# EAGLE design gpio expander (EAGLE 9.4.2)
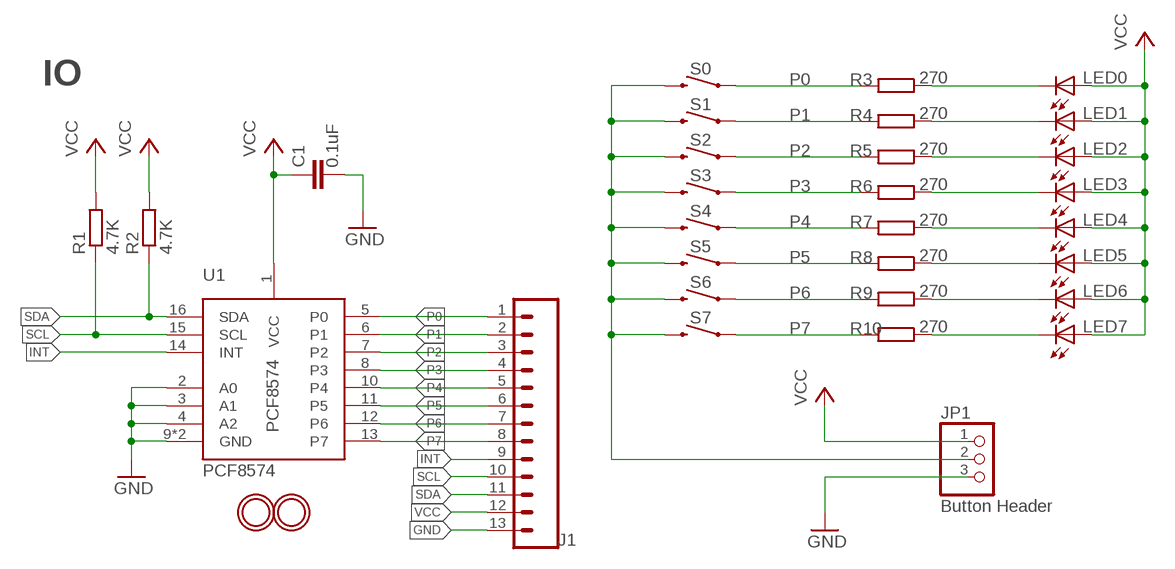
[diagram p0: schematic, sheet 1]

## Parts
C1  0.1uF  C-EUC0805K  [C0805K]
J1  GPIO Expander Pins  CONN_13  [1X13_NO_SILK]
JP1  Button Header  PINHD-1X3  [1X03]
LED0  GREEN  LEDCHIP-LED0805  [CHIP-LED0805]
LED1  GREEN  LEDCHIP-LED0805  [CHIP-LED0805]
LED2  GREEN  LEDCHIP-LED0805  [CHIP-LED0805]
LED3  GREEN  LEDCHIP-LED0805  [CHIP-LED0805]
LED4  GREEN  LEDCHIP-LED0805  [CHIP-LED0805]
LED5  GREEN  LEDCHIP-LED0805  [CHIP-LED0805]
LED6  GREEN  LEDCHIP-LED0805  [CHIP-LED0805]
LED7  GREEN  LEDCHIP-LED0805  [CHIP-LED0805]
MH1  MOUNTINGHOLE2.5  [MOUNTINGHOLE_2.5_PLATED]
MH3  MOUNTINGHOLE2.5  [MOUNTINGHOLE_2.5_PLATED]
R1  4.7K  R-EU_R0805  [R0805]
R2  4.7K  R-EU_R0805  [R0805]
R3  270  R-EU_R0805  [R0805]
R4  270  R-EU_R0805  [R0805]
R5  270  R-EU_R0805  [R0805]
R6  270  R-EU_R0805  [R0805]
R7  270  R-EU_R0805  [R0805]
R8  270  R-EU_R0805  [R0805]
R9  270  R-EU_R0805  [R0805]
R10  270  R-EU_R0805  [R0805]
S0  MOMENTARY-SWITCH-SPST-SMD-4.6X2.8MM  [TACTILE_SWITCH_SMD_4.6X2.8MM]
S1  MOMENTARY-SWITCH-SPST-SMD-4.6X2.8MM  [TACTILE_SWITCH_SMD_4.6X2.8MM]
S2  MOMENTARY-SWITCH-SPST-SMD-4.6X2.8MM  [TACTILE_SWITCH_SMD_4.6X2.8MM]
S3  MOMENTARY-SWITCH-SPST-SMD-4.6X2.8MM  [TACTILE_SWITCH_SMD_4.6X2.8MM]
S4  MOMENTARY-SWITCH-SPST-SMD-4.6X2.8MM  [TACTILE_SWITCH_SMD_4.6X2.8MM]
S5  MOMENTARY-SWITCH-SPST-SMD-4.6X2.8MM  [TACTILE_SWITCH_SMD_4.6X2.8MM]
S6  MOMENTARY-SWITCH-SPST-SMD-4.6X2.8MM  [TACTILE_SWITCH_SMD_4.6X2.8MM]
S7  MOMENTARY-SWITCH-SPST-SMD-4.6X2.8MM  [TACTILE_SWITCH_SMD_4.6X2.8MM]
U1  PCF8574  [QFN-16-3MM]

## Nets
GND [power1]: C1.2 J1.13 JP1.3 U1.2(A0) U1.3(A1) U1.4(A2) U1.9(GND) U1.P$1(GND)
INT: J1.9 U1.14(INT)
N$1: JP1.2 S0.3 S0.4 S1.3 S1.4 S2.3 S2.4 S3.3 S3.4 S4.3 S4.4 S5.3 S5.4 S6.3 S6.4 S7.3 S7.4
N$2: LED0.C R3.1
N$11: LED1.C R4.1
N$12: LED2.C R5.1
N$13: LED3.C R6.1
N$14: LED4.C R7.1
N$15: LED5.C R8.1
N$16: LED6.C R9.1
N$17: LED7.C R10.1
P0: J1.1 R3.2 S0.1 S0.2 U1.5(P0)
P1: J1.2 R4.2 S1.1 S1.2 U1.6(P1)
P2: J1.3 R5.2 S2.1 S2.2 U1.7(P2)
P3: J1.4 R6.2 S3.1 S3.2 U1.8(P3)
P4: J1.5 R7.2 S4.1 S4.2 U1.10(P4)
P5: J1.6 R8.2 S5.1 S5.2 U1.11(P5)
P6: J1.7 R9.2 S6.1 S6.2 U1.12(P6)
P7: J1.8 R10.2 S7.1 S7.2 U1.13(P7)
SCL: J1.10 R1.1 U1.15(SCL)
SDA: J1.11 R2.1 U1.16(SDA)
VCC [power1]: C1.1 J1.12 JP1.1 LED0.A LED1.A LED2.A LED3.A LED4.A LED5.A LED6.A LED7.A R1.2 R2.2 U1.1(VCC)

## Notes on the sheet
- IO

## Library data of the parts
C1 = rcl:C-EU: CAPACITOR, European symbol; SPICEPREFIX: C
J1 = AK74:CONN_13
JP1 = pinhead:PINHD-1X3: PIN HEADER
LED0 LED1-LED7 = led:LED: LED OSRAM: - CHIPLED LG R971, LG N971, LY N971, LG Q971, LY Q971, LO R971, LY R971 LH N974, LH R974 LS Q976, LO Q976, LY Q976 LO Q996 - Hyper CHIPLED LW Q18S LB Q993, LB Q99A, LB R99A - SideLED LS A670, LO A670, LY A670, LG A670, LP A670 LB A673, LV A673, LT A673, LW A673 LH A674 LY A675 LS A676, LA A676, LO A676, LY A676, LW A676 LS A679, LY A679, LG A679 - Hyper Micro SIDELED® LS Y876, LA Y876, LO Y876, LY Y876 LT Y87S - SmartLED LW L88C, LW L88S LB L89C, LB L89S, LG L890 LS L89K, LO L89K, LY L89K LS L896, LA L896, LO L896, LY L896 - TOPLED LS T670, LO T670, LY T670, LG T670, LP T670 LSG T670, LSP T670, LSY T670, LOP T670, LYG T670 LG T671, LOG T671, LSG T671 LB T673, LV T673, LT T673, LW T673 LH T674 LS T676, LA T676, LO T676, LY T676, LB T676, LH T676, LSB T676, LW T676 LB T67C, LV T67C, LT T67C, LS T67K, LO T67K, LY T67K, LW E67C LS E67B, LA E67B, LO E67B, LY E67B, LB E67C, LV E67C, LT E67C LW T67C LS T679, LY T679, LG T679 LS T770, LO T770, LY T770, LG T770, LP T770 LB T773, LV T773, LT T773, LW T773 LH T774 LS E675, LA E675, LY E675, LS T675 LS T776, LA T776, LO T776, LY T776, LB T776 LHGB T686 LT T68C, LB T68C - Hyper Mini TOPLED® LB M676 - Mini TOPLED Santana® LG M470 LS M47K, LO M47K, LY M47K Source: http://www.osram.convergy.de LUXEON: - LUMILED® LXK2-PW12-R00, LXK2-PW12-S00, LXK2-PW14-U00, LXK2-PW14-V00 LXK2-PM12-R00, LXK2-PM12-S00, LXK2-PM14-U00 LXK2-PE12-Q00, LXK2-PE12-R00, LXK2-PE12-S00, LXK2-PE14-T00, LXK2-PE14-U00 LXK2-PB12-K00, LXK2-PB12-L00, LXK2-PB12-M00, LXK2-PB14-N00, LXK2-PB14-P00, LXK2-PB14-Q00 LXK2-PR12-L00, LXK2-PR12-M00, LXK2-PR14-Q00, LXK2-PR14-R00 LXK2-PD12-Q00, LXK2-PD12-R00, LXK2-PD12-S00 LXK2-PH12-R00, LXK2-PH12-S00 LXK2-PL12-P00, LXK2-PL12-Q00, LXK2-PL12-R00 Source: www.luxeon.com KINGBRIGHT: KA-3528ASYC Source: www.kingbright.com
MH1 MH3 = microbuilder:MOUNTINGHOLE: Mounting Hole For #2 screws (0.086"/2.18mm width, 0.094"/2.4mm hole) use 2.5mm
R1-R10 = rcl:R-EU_: RESISTOR, European symbol; SPICEPREFIX: R
S0 S1-S7 = SparkFun-Switches:MOMENTARY-SWITCH-SPST: Momentary Switch (Pushbutton) - SPST Normally-open (NO) SPST momentary switches (buttons, pushbuttons). Variants PTH-12MM - 12mm square, through-hole Momentary Pushbutton Switch - 12mm Square <https://www.sparkfun.com/products/9190> (COM-09190) PTH-6.0MM, PTH-6.0MM-KIT - 6.0mm square, through-hole Mini Pushbutton Switch <https://www.sparkfun.com/products/97> (COM-00097) KIT package intended for soldering kit's - only one side of pads' copper is exposed. PTH-RIGHT-ANGLE-KIT - Right-angle, through-hole Right Angle Tactile Button <https://www.sparkfun.com/products/10791> - Used on SparkFun BigTime Watch Kit <https://www.sparkfun.com/products/11734> SMD-12MM - 12mm square, surface-mount Tactile Button - SMD (12mm) <https://www.sparkfun.com/products/12993> (COM-12993) Used on SparkFun PicoBoard <https://www.sparkfun.com/products/11888> SMD-4.5MM - 4.5mm Square Trackball Switch Used on SparkFun Blackberry Trackballer Breakout <https://www.sparkfun.com/products/13169> SMD-4.6MMX2.8MM - 4.60mm x 2.80mm, surface mount Used on SparkFun SAMD21 Mini Breakout <https://www.sparkfun.com/products/13664> SMD-5.2MM, SMD-5.2-REDUNDANT - 5.2mm square, surface-mount Mini Pushbutton Switch - SMD <https://www.sparkfun.com/products/8720> (COM-08720) Used on Arduino Pro Mini <https://www.sparkfun.com/products/11114> REDUNDANT package connects both switch circuits together SMD-6.0X3.5MM - 6.0 x 3.5mm, surface mount Momentary Reset Switch SMD <https://www.sparkfun.com/products/8229> (COM-08229) SMD-6.2MM-TALL - 6.2mm square, surface mount Tactile Button - SMD (6mm) <https://www.sparkfun.com/products/12992> Used on SparkFun Digital Sandbox <https://www.sparkfun.com/products/12651> SMD-RIGHT-ANGLE - Right-angle, surface mount Used on SparkFun Block for Intel® Edison - Arduino <https://www.sparkfun.com/products/13036>; PROD_ID: SWCH-13065
U1 = AK74:PCF8574

## Net classes
0 default: width 0.152 mm
1 power1: width 0.254 mm

## Board
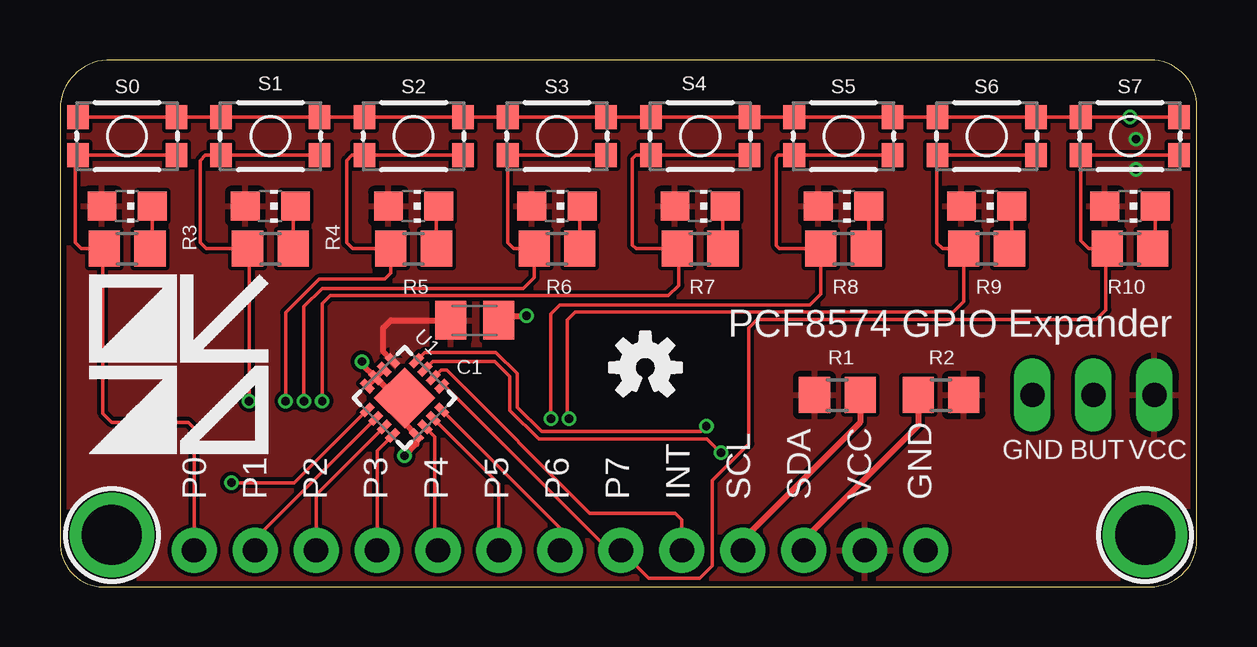
[diagram p1: board, top side]
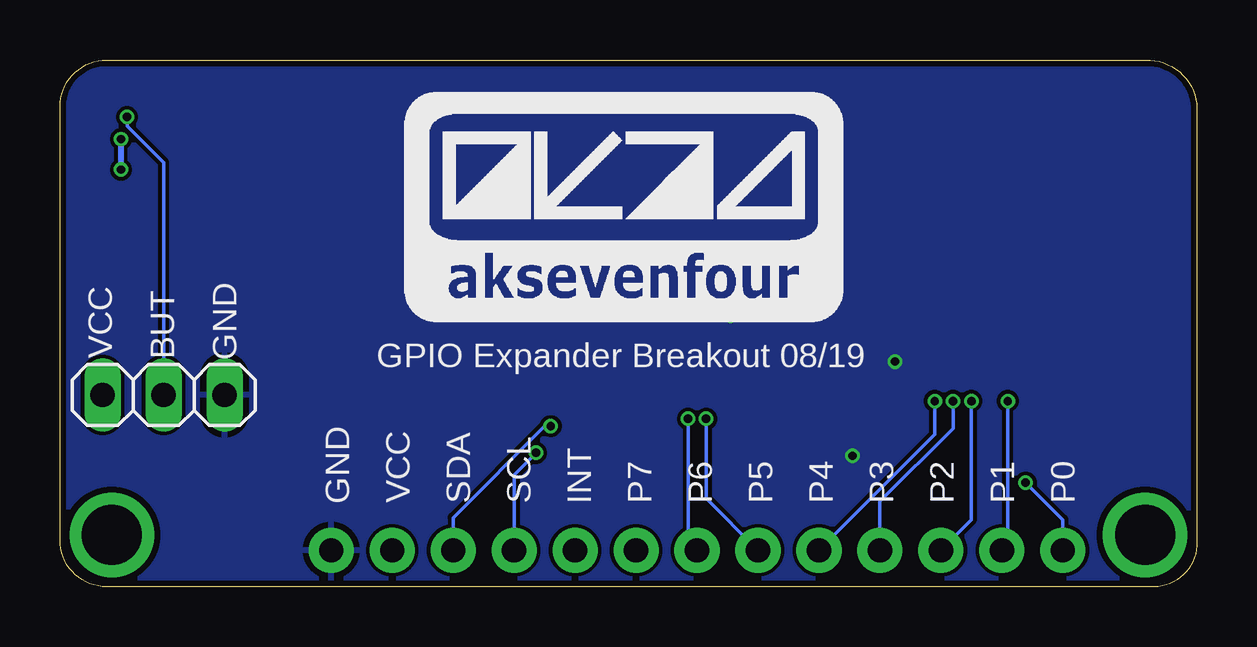
[diagram p2: board, bottom side, seen from below]

Size 47.37 x 21.97 mm. Coordinates in mm from the lower left corner, seen from the top.
Outline: 1.96,0 45.43,0 arc90 47.37,1.96 47.37,20.02 arc90 45.43,21.97 1.95,21.97 arc90 0,19.76 0,1.71 arc90 1.96,0
Copper layers (1*16): Top 0.07mm / dielectric 1.5mm / Bottom 0.07mm
Design rules "jlcpcb-2layer": minimum track width 5mil, minimum drill 0.2mm, track to track 6mil, track to pad 6mil, pad to pad 6mil, via to via 6mil, smd to smd 6mil, copper to edge 10mil, drill to drill 5mil, minimum pad ring 10mil, minimum via ring 5mil, stop-mask expansion 2mil, vias tented up to drill 0mil, thermal gap 10mil

### Footprints (pad centres in the part's own frame; a part is rotated, then mirrored left to right if it is on the bottom)
C0805K = smd 1.3 x 1.6: 1 -1,0; 2 1,0
1X13_NO_SILK = drill 1.016 pad 1.88: 1 0,0; 2 2.54,0; 3 5.08,0; 4 7.62,0; 5 10.16,0; 6 12.7,0; 7 15.24,0; 8 17.78,0; 9 20.32,0; 10 22.86,0; 11 25.4,0; 12 27.94,0; 13 30.48,0
1X03 = drill 1.016 long: 1 -2.54,0; 2 0,0; 3 2.54,0
CHIP-LED0805 = smd 1.2 x 1.2: A 0,-1.05; C 0,1.05
MOUNTINGHOLE_2.5_PLATED = drill 2.5 pad 3.2: P$1 0,0
R0805 = smd 1.3 x 1.5: 1 -0.95,0; 2 0.95,0
TACTILE_SWITCH_SMD_4.6X2.8MM = smd 0.9 x 1: 1 -2.05,-0.8; 2 2.05,-0.8; 3 2.05,0.8; 4 -2.05,0.8
QFN-16-3MM = smd 0.6 x 0.3: 1 -1.45,0.75; 2 -1.45,0.25; 3 -1.45,-0.25; 4 -1.45,-0.75; 9 1.45,-0.75; 10 1.45,-0.25; 11 1.45,0.25; 12 1.45,0.75 | smd 0.3 x 0.6: 5 -0.75,-1.45; 6 -0.25,-1.45; 7 0.25,-1.45; 8 0.75,-1.45; 13 0.75,1.45; 14 0.25,1.45; 15 -0.25,1.45; 16 -0.75,1.45 | smd 1.8 x 1.8: P$1 0,0

### Placement (x,y rotation side)
C1  17.28,11.12 0 top
J1  5.59,1.53 0 top
JP1  43.06,8 0 bottom
LED0  2.8,15.88 270 top
LED1  8.77,15.88 270 top
LED2  14.74,15.88 270 top
LED3  20.7,15.88 270 top
LED4  26.67,15.88 270 top
LED5  32.64,15.88 270 top
LED6  38.61,15.88 270 top
LED7  44.58,15.88 270 top
MH1  45.22,2.16 180 top
MH3  2.16,2.16 180 top
R1  32.39,8 180 top
R2  36.71,8 0 top
R3  2.8,14.1 180 top
R4  8.77,14.1 180 top
R5  14.74,14.1 180 top
R6  20.7,14.1 180 top
R7  26.67,14.1 180 top
R8  32.64,14.1 180 top
R9  38.61,14.1 180 top
R10  44.58,14.1 180 top
S0  2.8,18.8 0 top
S1  8.77,18.8 0 top
S2  14.74,18.8 0 top
S3  20.7,18.8 0 top
S4  26.67,18.8 0 top
S5  32.64,18.8 0 top
S6  38.61,18.8 0 top
S7  44.58,18.8 0 top
U1  14.35,7.88 315 top
U$1  [AK74_LOGO_MEDIUM]  24.12,17.4 0 bottom
U$2  [AK74_LOGO_MEDIUM_TEXTONLY_SQUARE]  8.51,11.43 0 top
U$3  [OSHW-LOGO-S]  24.39,9.15 0 top

### Tracks (layer width: path | path; a pad name or v marks a point on that pad's centre or on a via)
GND  (via drill 0.35)
  Top 0.254: U1.3 12.58,9.3 v12.58,9.4 | v14.35,5.46 14.85,5.96 U1.9 14.35,6.82 U1.P$1 14,7.88 U1.3 | C1.2 18.47,11.31 v19.43,11.31 | U1.4 | U1.4 U1.3 | U1.3 U1.2
  pour Bottom: 48.71,-1.46 48.71,26.29 -1.39,26.55 -1.39,-1.46
INT
  Top 0.152: U1.14 15.88,9.05 16.11,9.05 22.08,3.08 25.63,3.08 25.91,2.8 J1.9
N$1  (via drill 0.35)
  Top 0.152: S0.4 S0.3 S1.4 S1.3 S2.4 S2.3 S3.4 S3.3 S4.4 S4.3 S5.4 S5.3 S6.4 S6.3 S7.4 v44.58,19.6 S7.3
  Bottom 0.152: JP1.2 43.06,17.69 44.58,19.22 v44.58,19.6
N$2
  Top 0.152: R3.1 3.85,14.2 LED0.C
N$11
  Top 0.152: R4.1 9.72,15.78 LED1.C
N$12
  Top 0.152: R5.1 15.69,15.78 LED2.C
N$13
  Top 0.152: R6.1 21.65,15.78 LED3.C
N$14
  Top 0.152: R7.1 27.62,15.78 LED4.C
N$15
  Top 0.152: LED5.C 33.69,14.2 R8.1
N$16
  Top 0.152: LED6.C 39.66,14.2 R9.1
N$17
  Top 0.152: LED7.C 45.63,14.2 R10.1
P0  (via drill 0.35)
  Top 0.152: J1.1 5.59,6.61 5.34,6.86 2.16,6.86 1.78,7.24 1.78,14.03 R3.2 0.89,14.1 0.64,14.35 0.64,17.89 S0.1 S0.2 | U1.5 9.76,4.35 v7.14,4.35
  Bottom 0.152: v7.14,4.35 5.59,2.8 J1.1
P1  (via drill 0.35)
  Top 0.152: S1.2 S1.1 6.06,18 5.85,17.78 5.85,14.35 6.1,14.1 R4.2 7.88,14.03 v7.88,7.75 | U1.6 8.13,2.01 J1.2
  Bottom 0.152: J1.2 8,1.65 8,2.04 7.88,2.16 v7.88,7.75
P2  (via drill 0.35)
  Top 0.152: S2.2 S2.1 12.16,18 11.94,17.78 11.94,14.35 12.2,14.1 R5.2 13.79,13.08 13.53,12.83 10.8,12.83 9.4,11.43 v9.4,7.75 | U1.7 10.67,3.84 J1.3
  Bottom 0.152: v9.4,7.75 9.4,2.8 J1.3
P3  (via drill 0.35)
  Top 0.152: S3.2 S3.1 18.65,14.35 18.91,14.1 R6.2 19.75,12.9 19.31,12.45 10.93,12.45 10.16,11.69 v10.16,7.75 | U1.8 13.21,5.67 J1.4
  Bottom 0.152: J1.4 13.21,3.56 10.16,6.61 v10.16,7.75
P4  (via drill 0.35)
  Top 0.152: U1.10 15.62,6.25 15.62,1.65 J1.5 | S4.2 S4.1 23.99,18 23.85,17.86 23.85,14.25 24.01,14.1 R7.2 25.78,14.04 25.78,12.58 25.35,12.14 11.26,12.14 10.93,11.81 v10.93,7.75
  Bottom 0.152: J1.5 10.93,6.35 v10.93,7.75
P5  (via drill 0.35)
  Top 0.152: U1.11 18.29,4.29 J1.6 | S5.2 S5.1 29.94,18 29.85,17.91 29.85,14.23 29.98,14.1 R8.2 31.69,12.21 31.25,11.76 20.83,11.76 20.45,11.38 v20.45,7.01
  Bottom 0.152: v20.45,7.01 20.45,3.69 J1.6
P6  (via drill 0.35)
  Top 0.152: U1.12 20.83,2.46 J1.7 | S6.2 S6.1 36.53,17.96 36.53,14.35 36.77,14.1 R9.2 37.66,11.91 37.21,11.46 21.47,11.46 21.14,11.13 21.14,7.08 v21.21,7.01
  Bottom 0.152: v21.21,7.01 21.21,1.9 J1.7
P7
  Top 0.152: U1.13 16.04,8.37 22.88,1.53 J1.8 24.54,0.36 26.65,0.36 27.18,0.89 27.18,4.45 28.71,5.97 28.71,10.8 29.06,11.15 43.18,11.15 43.58,11.55 43.58,14.05 R10.2 42.87,14.1 42.53,14.44 S7.1 S7.2
SCL  (via drill 0.35)
  Top 0.152: U1.15 15.52,9.4 18.11,9.4 18.75,8.77 18.75,7.37 19.94,6.18 26.96,6.18 v27.54,5.59
  Top 0.254: R1.1 33.34,6.86 28.45,1.97 J1.10
  Bottom 0.152: v27.54,5.59 28.45,4.68 J1.10
SDA  (via drill 0.35)
  Top 0.152: U1.16 15.2,9.78 18.16,9.78 19.05,8.89 19.05,7.49 20.07,6.48 26.7,6.48 v26.93,6.71
  Top 0.254: R2.1 35.76,6.73 30.99,1.97 J1.11
  Bottom 0.152: v26.93,6.71 27.18,6.71 30.99,2.89 J1.11
VCC  (via drill 0.35)
  Top 0.254: U1.1 13.47,9.83 13.47,10.8 13.78,11.12 C1.1
  Bottom 0.254: v44.83,18.67 v44.83,17.4
  pour Top: 22.73,-0.5 47.88,-0.63 48.14,-0.38 48.14,25.66 48.02,25.77 -0.76,25.77 -0.76,-0.5

### Text on the board
tPlace: PCF8574 GPIO Expander | GND | BUT | VCC | P0 | P1 | P2 | P3 | P4 | P5 | P6 | P7 | INT | SCL | SDA | VCC | GND
bPlace: GND | VCC | BUT | GPIO Expander Breakout 08/19 | INT | SCL | SDA | VCC | GND | P0 | P1 | P2 | P3 | P4 | P5 | P6 | P7